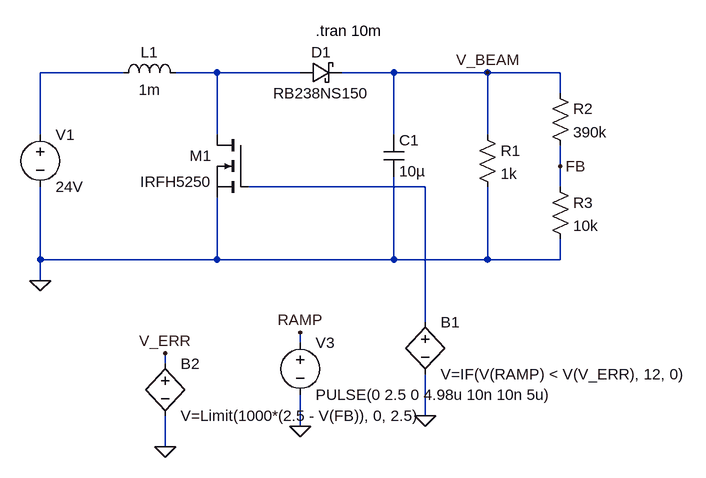
[diagram p0: schematic beam_boost.asc]
beam_boost.asc, the LTspice schematic file:
Version 4
SHEET 1 1464 1008
WIRE 448 288 320 288
WIRE 592 288 528 288
WIRE 720 288 592 288
WIRE 864 288 784 288
WIRE 1008 288 864 288
WIRE 1120 288 1008 288
WIRE 1120 320 1120 288
WIRE 320 384 320 288
WIRE 592 384 592 288
WIRE 864 384 864 288
WIRE 1008 384 1008 288
WIRE 1120 432 1120 400
WIRE 912 464 640 464
WIRE 1120 464 1120 432
WIRE 320 576 320 464
WIRE 592 576 592 480
WIRE 592 576 320 576
WIRE 864 576 864 448
WIRE 864 576 592 576
WIRE 1008 576 1008 464
WIRE 1008 576 864 576
WIRE 1120 576 1120 544
WIRE 1120 576 1008 576
WIRE 320 608 320 576
WIRE 912 672 912 464
WIRE 720 704 720 688
WIRE 512 736 512 720
WIRE 912 816 912 752
WIRE 720 832 720 784
WIRE 512 864 512 816
FLAG 320 608 0
FLAG 1120 432 FB
FLAG 512 864 0
FLAG 720 832 0
FLAG 912 816 0
FLAG 720 688 RAMP
FLAG 512 720 V_ERR
FLAG 1008 288 V_BEAM
SYMBOL voltage 320 368 R0
SYMATTR InstName V1
SYMATTR Value 24V
SYMBOL ind 432 304 R270
WINDOW 0 32 56 VTop 2
WINDOW 3 5 56 VBottom 2
SYMATTR InstName L1
SYMATTR Value 1m
SYMBOL nmos 640 384 M0
SYMATTR InstName M1
SYMATTR Value IRFH5250
SYMBOL cap 848 384 R0
SYMATTR InstName C1
SYMATTR Value 10µ
SYMBOL res 992 368 R0
SYMATTR InstName R1
SYMATTR Value 1k
SYMBOL res 1104 304 R0
SYMATTR InstName R2
SYMATTR Value 390k
SYMBOL res 1104 448 R0
SYMATTR InstName R3
SYMATTR Value 10k
SYMBOL voltage 720 688 R0
SYMATTR InstName V3
SYMATTR Value PULSE(0 2.5 0 4.98u 10n 10n 5u)
SYMBOL bv 912 656 R0
SYMATTR InstName B1
SYMATTR Value V=IF(V(RAMP) < V(V_ERR), 12, 0)
SYMBOL schottky 720 304 R270
WINDOW 0 32 32 VTop 2
WINDOW 3 0 32 VBottom 2
SYMATTR InstName D1
SYMATTR Value RB238NS150
SYMATTR Description Diode
SYMATTR Type diode
SYMBOL bv 512 720 R0
SYMATTR InstName B2
SYMATTR Value V=Limit(1000*(2.5 - V(FB)), 0, 2.5)
TEXT 744 224 Left 2 !.tran 10m

The netlist it stands for:
* beam_boost.asc
V1 N001 0 24V
L1 N001 N002 1m
M1 N002 N003 0 0 IRFH5250
C1 V_BEAM 0 10µ
R1 V_BEAM 0 1k
R2 V_BEAM FB 390k
R3 FB 0 10k
V3 RAMP 0 PULSE(0 2.5 0 4.98u 10n 10n 5u)
B1 N003 0 V=IF(V(RAMP) < V(V_ERR), 12, 0)
D1 N002 V_BEAM RB238NS150
B2 V_ERR 0 V=Limit(1000*(2.5 - V(FB)), 0, 2.5)
.model D D
.lib standard.dio
.model NMOS NMOS
.model PMOS PMOS
.lib standard.mos
.tran 10m
.backanno
.end